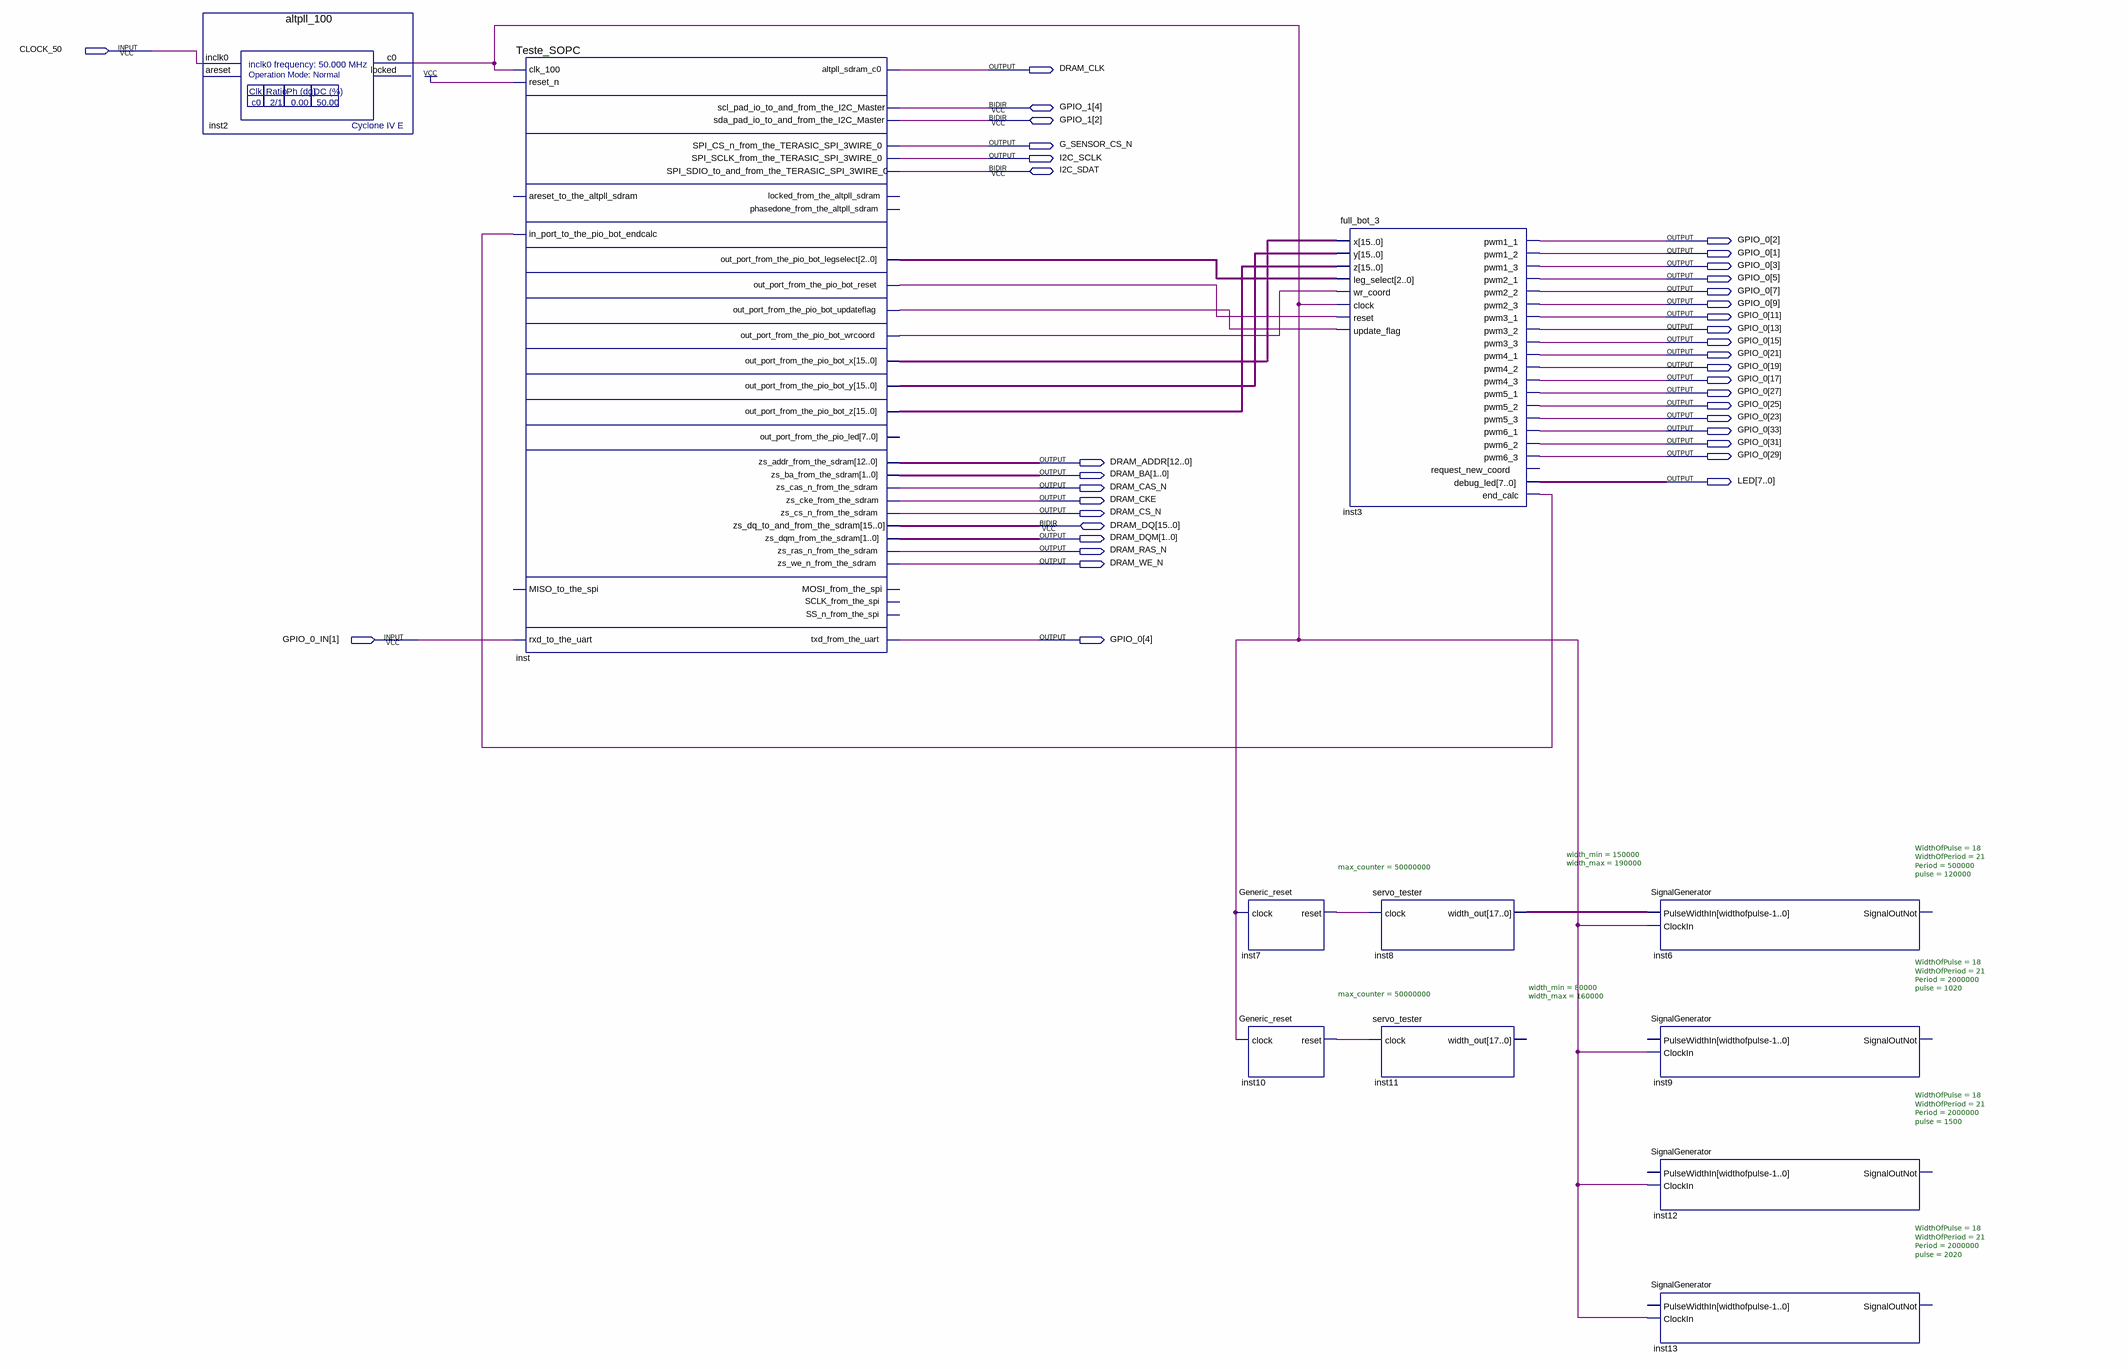
[diagram p0: schematic sheet]
// Quartus schematic TesteNIOS.bdf as structural Verilog: 11 symbols, 37 pins
module TesteNIOS (
  input  CLOCK_50,
  input  [1:1] GPIO_0_IN,
  inout  [4:2] GPIO_1,
  inout  I2C_SDAT,
  inout  [15:0] DRAM_DQ,
  output DRAM_CLK,
  output G_SENSOR_CS_N,
  output I2C_SCLK,
  output [33:1] GPIO_0,
  output [12:0] DRAM_ADDR,
  output [1:0] DRAM_BA,
  output [7:0] LED,
  output DRAM_CAS_N,
  output DRAM_CKE,
  output DRAM_CS_N,
  output [1:0] DRAM_DQM,
  output DRAM_RAS_N,
  output DRAM_WE_N
);

  wire inst2_c0, inst3_end_calc, inst7_reset, inst10_reset, inst_out_port_from_the_pio_bot_reset,
       inst_out_port_from_the_pio_bot_updateflag, inst_out_port_from_the_pio_bot_wrcoord;
  wire [2:0] inst_out_port_from_the_pio_bot_legselect;
  wire [15:0] inst_out_port_from_the_pio_bot_x, inst_out_port_from_the_pio_bot_y,
       inst_out_port_from_the_pio_bot_z;
  wire [17:0] inst8_width_out;

  altpll_100 inst2 (.inclk0(CLOCK_50), .c0(inst2_c0));  // open: areset, locked
  Teste_SOPC inst (
    .clk_100(inst2_c0), .reset_n(1'b1), .in_port_to_the_pio_bot_endcalc(inst3_end_calc),
    .rxd_to_the_uart(GPIO_0_IN[1]), .altpll_sdram_c0(DRAM_CLK),
    .SPI_CS_n_from_the_TERASIC_SPI_3WIRE_0(G_SENSOR_CS_N), .SPI_SCLK_from_the_TERASIC_SPI_3WIRE_0(I2C_SCLK),
    .out_port_from_the_pio_bot_legselect(inst_out_port_from_the_pio_bot_legselect),
    .out_port_from_the_pio_bot_reset(inst_out_port_from_the_pio_bot_reset),
    .out_port_from_the_pio_bot_updateflag(inst_out_port_from_the_pio_bot_updateflag),
    .out_port_from_the_pio_bot_wrcoord(inst_out_port_from_the_pio_bot_wrcoord),
    .out_port_from_the_pio_bot_x(inst_out_port_from_the_pio_bot_x),
    .out_port_from_the_pio_bot_y(inst_out_port_from_the_pio_bot_y),
    .out_port_from_the_pio_bot_z(inst_out_port_from_the_pio_bot_z), .zs_addr_from_the_sdram(DRAM_ADDR),
    .zs_ba_from_the_sdram(DRAM_BA), .zs_cas_n_from_the_sdram(DRAM_CAS_N), .zs_cke_from_the_sdram(DRAM_CKE),
    .zs_cs_n_from_the_sdram(DRAM_CS_N), .zs_dqm_from_the_sdram(DRAM_DQM),
    .zs_ras_n_from_the_sdram(DRAM_RAS_N), .zs_we_n_from_the_sdram(DRAM_WE_N), .txd_from_the_uart(GPIO_0[4]),
    .scl_pad_io_to_and_from_the_I2C_Master(GPIO_1[4]), .sda_pad_io_to_and_from_the_I2C_Master(GPIO_1[2]),
    .SPI_SDIO_to_and_from_the_TERASIC_SPI_3WIRE_0(I2C_SDAT), .zs_dq_to_and_from_the_sdram(DRAM_DQ));  // open: areset_to_the_altpll_sdram, MISO_to_the_spi, locked_from_the_altpll_sdram, phasedone_from_the_altpll_sdram, out_port_from_the_pio_led, MOSI_from_the_spi, SCLK_from_the_spi, SS_n_from_the_spi
  Generic_reset #(.max_counter(50000000)) inst7 (.clock(inst2_c0), .reset(inst7_reset));
  Generic_reset #(.max_counter(50000000)) inst10 (.clock(inst2_c0), .reset(inst10_reset));
  full_bot_3 inst3 (
    .x(inst_out_port_from_the_pio_bot_x), .y(inst_out_port_from_the_pio_bot_y),
    .z(inst_out_port_from_the_pio_bot_z), .leg_select(inst_out_port_from_the_pio_bot_legselect),
    .wr_coord(inst_out_port_from_the_pio_bot_wrcoord), .clock(inst2_c0),
    .reset(inst_out_port_from_the_pio_bot_reset), .update_flag(inst_out_port_from_the_pio_bot_updateflag),
    .pwm1_1(GPIO_0[2]), .pwm1_2(GPIO_0[1]), .pwm1_3(GPIO_0[3]), .pwm2_1(GPIO_0[5]), .pwm2_2(GPIO_0[7]),
    .pwm2_3(GPIO_0[9]), .pwm3_1(GPIO_0[11]), .pwm3_2(GPIO_0[13]), .pwm3_3(GPIO_0[15]), .pwm4_1(GPIO_0[21]),
    .pwm4_2(GPIO_0[19]), .pwm4_3(GPIO_0[17]), .pwm5_1(GPIO_0[27]), .pwm5_2(GPIO_0[25]), .pwm5_3(GPIO_0[23]),
    .pwm6_1(GPIO_0[33]), .pwm6_2(GPIO_0[31]), .pwm6_3(GPIO_0[29]), .debug_led(LED), .end_calc(inst3_end_calc));  // open: request_new_coord
  servo_tester #(.width_min(150000), .width_max(190000)) inst8 (.clock(inst7_reset), .width_out(inst8_width_out));
  servo_tester #(.width_min(80000), .width_max(160000)) inst11 (.clock(inst10_reset));  // open: width_out
  SignalGenerator #(.WidthOfPulse(18), .WidthOfPeriod(21), .Period(500000), .pulse(120000)) inst6 (
    .PulseWidthIn(inst8_width_out), .ClockIn(inst2_c0));  // open: SignalOutNot
  SignalGenerator #(.WidthOfPulse(18), .WidthOfPeriod(21), .Period(2000000), .pulse(1020)) inst9 (.ClockIn(inst2_c0));  // open: PulseWidthIn, SignalOutNot
  SignalGenerator #(.WidthOfPulse(18), .WidthOfPeriod(21), .Period(2000000), .pulse(1500)) inst12 (.ClockIn(inst2_c0));  // open: PulseWidthIn, SignalOutNot
  SignalGenerator #(.WidthOfPulse(18), .WidthOfPeriod(21), .Period(2000000), .pulse(2020)) inst13 (.ClockIn(inst2_c0));  // open: PulseWidthIn, SignalOutNot
endmodule
